# EasyEDA schematic HAM-LM_V2.6E.json
TITLE: HAM - ESP_LM; REV: 2.6E; Date: 2025-03-19; Sheet: 1/1; Drawn By: Huy T Huong; Company: UB Extreme Environments Laboratory
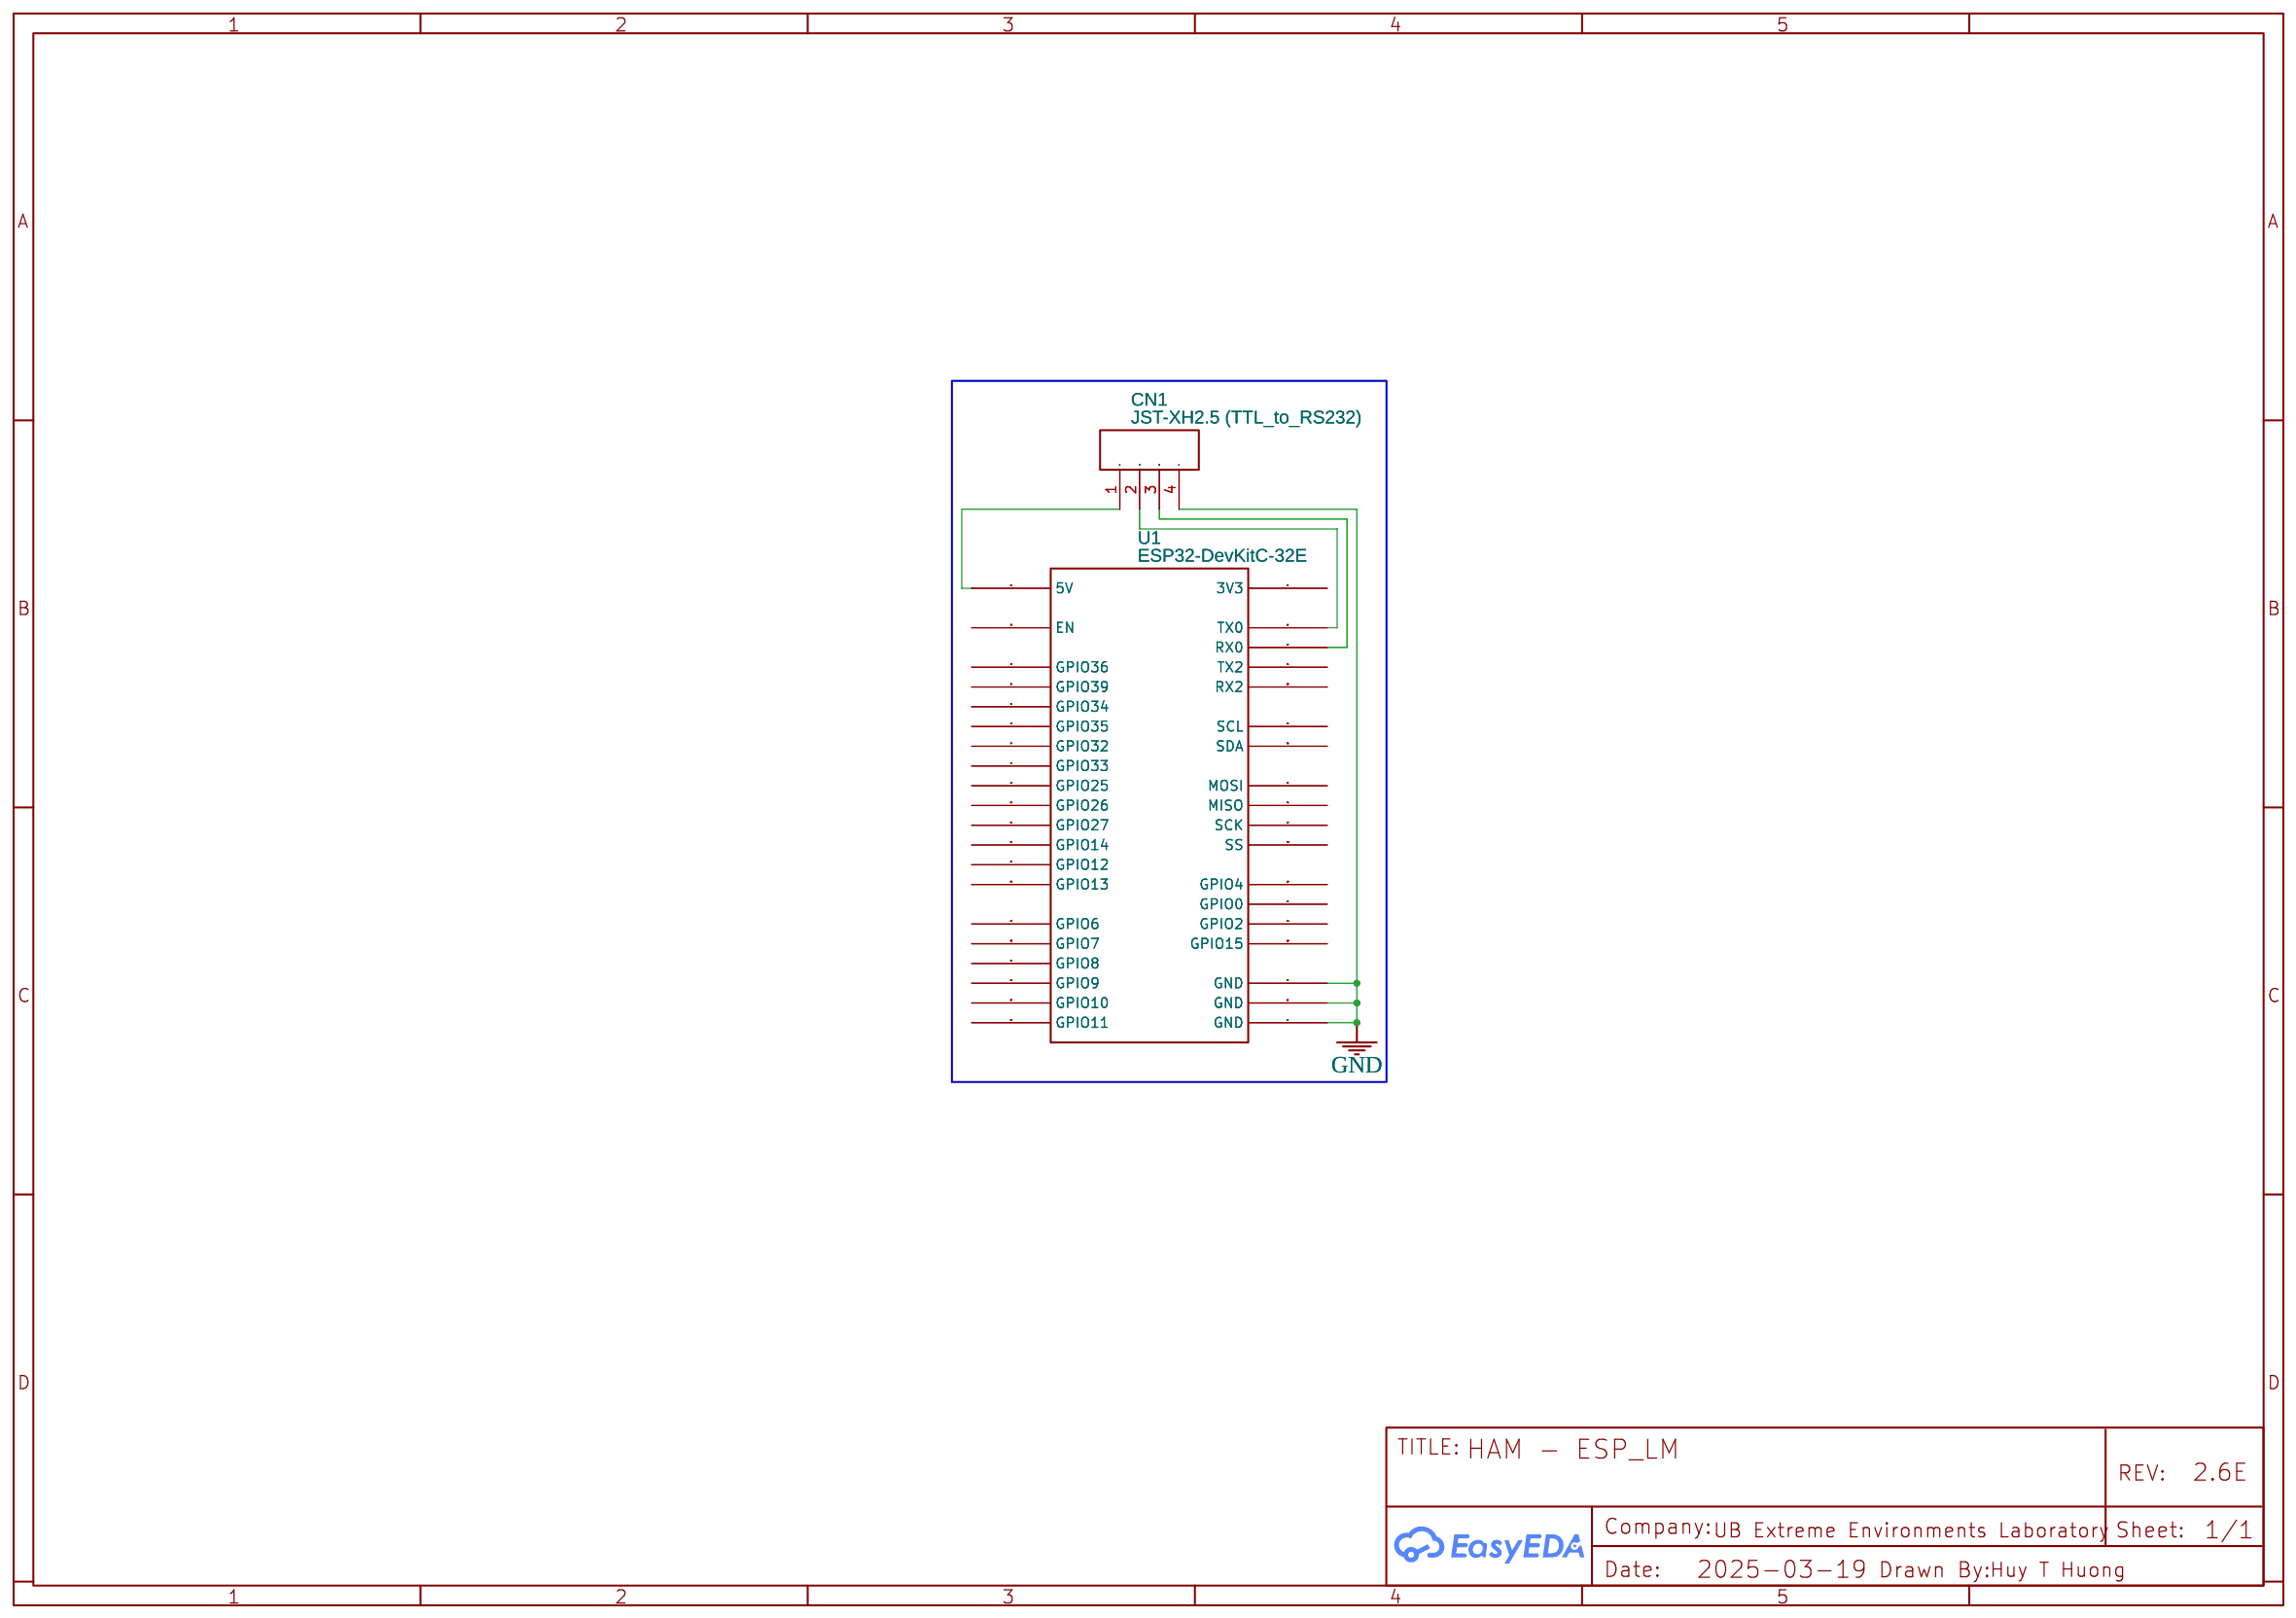
[diagram p0: schematic sheet]

## Parts
CN1  JST-XH2.5 (TTL_to_RS232)  [4PIN_2.54_MM_JST_XHP_JST_CONNECTOR_FOR_DC_SOCKET]
U1  ESP32-DevKitC-32E  [ESP32-DEVKITC-32E]

## Library data of the parts
CN1 = JST-XH2.54- 4 PIN Y COPY: Contributor: moorpcbs
U1 = ESP32-DevKitC-32E: Manufacturer: Espressif Systems; Supplier: Mouser; link: https://www.mouser.be/ProductDetail/Espressif-Systems/ESP32-DevKitC-32E?qs=GedFDFLaBXFpgD0kAZWDrQ%3D%3D; Contributor: CyanTech

## Nets
GND: CN1.4 U1.J1_14(GND) U1.J3_1(GND) U1.J3_7(GND)
Net-(CN1-1): CN1.1 U1.J1_19(5V)
Net-(CN1-2): CN1.2 U1.J3_4(TX0)
Net-(CN1-3): CN1.3 U1.J3_5(RX0)

Not connected (* = marked no-connect by the designer): U1 J1_1(3V3) J1_2(EN) J1_3(GPIO36) J1_4(GPIO39) J1_5(GPIO34) J1_6(GPIO35) J1_7(GPIO32) J1_8(GPIO33) J1_9(GPIO25) J1_10(GPIO26) J1_11(GPIO27) J1_12(GPIO14) J1_13(GPIO12) J1_15(GPIO13) J1_16(GPIO9) J1_17(GPIO10) J1_18(GPIO11) J3_2(MOSI) J3_3(SCL) J3_6(SDA) J3_8(MISO) J3_9(SCK) J3_10(SS) J3_11(TX2) J3_12(RX2) J3_13(GPIO4) J3_14(GPIO0) J3_15(GPIO2) J3_16(GPIO15) J3_17(GPIO8) J3_18(GPIO7) J3_19(GPIO6)
